# Altium schematic sheet 07_Peripheral_Part.SchDoc
size A3; SheetNumber: 7; SheetTotal: 8
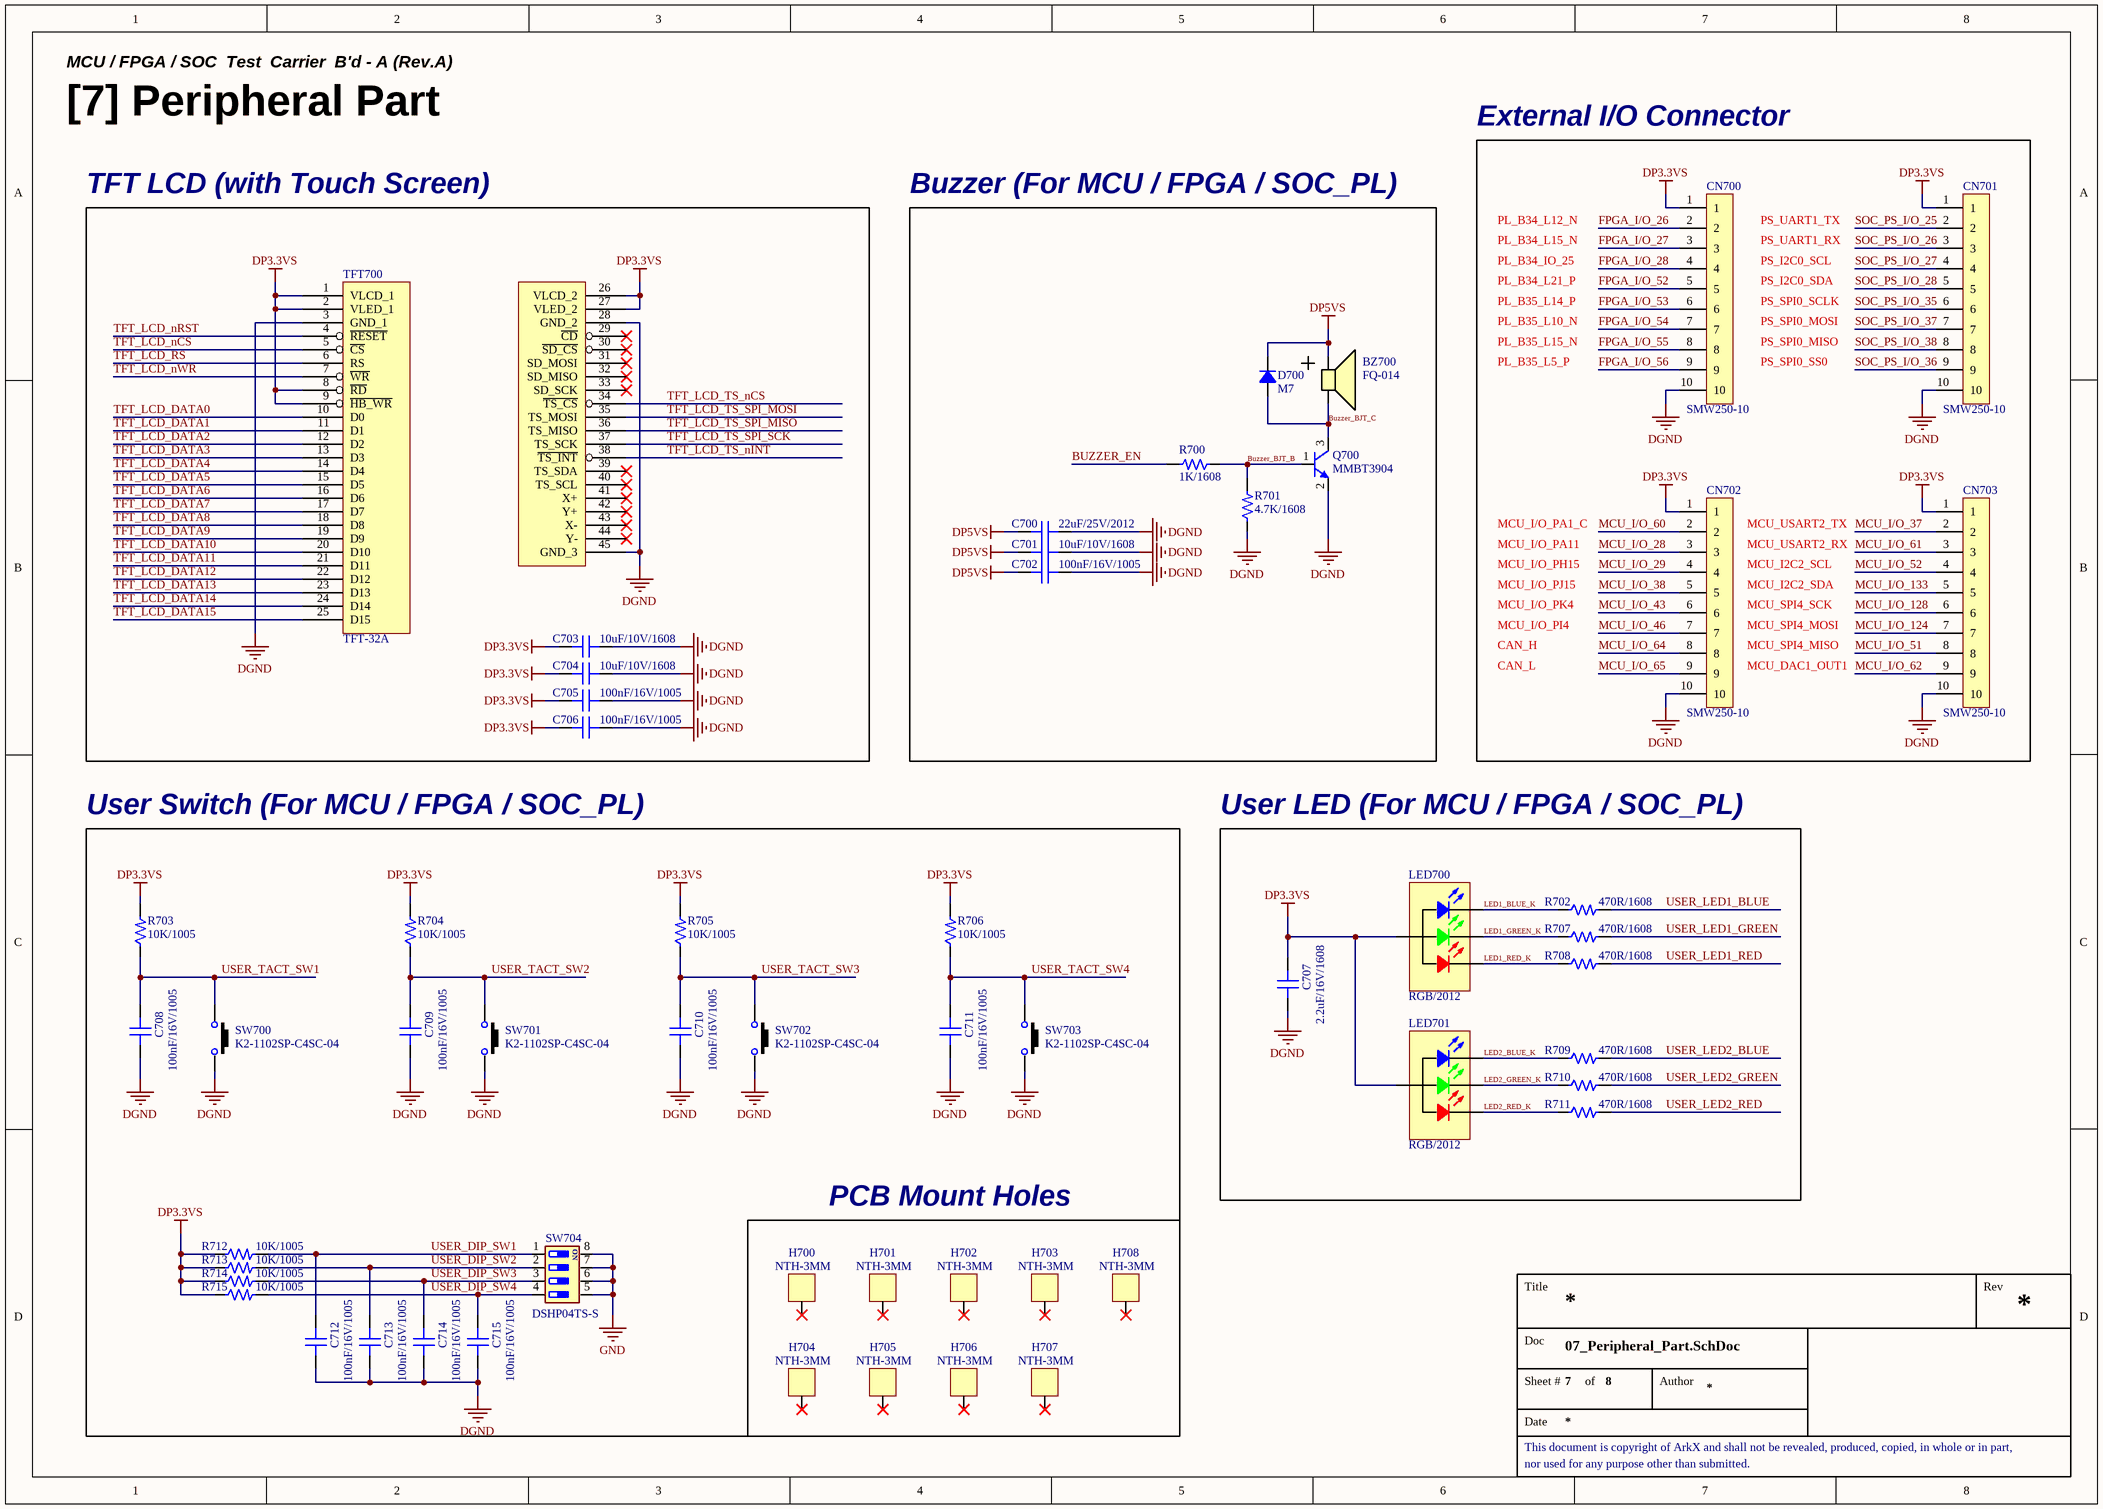
[diagram p0: 07_Peripheral_Part.SchDoc]

## Parts
BZ700  FQ-014  [BUZ FQ-013]
C700  22uF/25V/2012  [CAP 2012 (0805_INCH)]
C701  10uF/10V/1608  [CAP 1608 (0603_INCH)]
C702  100nF/16V/1005  [CAP 1005 (0402_INCH)]
C703  10uF/10V/1608  [CAP 1608 (0603_INCH)]
C704  10uF/10V/1608  [CAP 1608 (0603_INCH)]
C705  100nF/16V/1005  [CAP 1005 (0402_INCH)]
C706  100nF/16V/1005  [CAP 1005 (0402_INCH)]
C707  2.2uF/16V/1608  [CAP 1608 (0603_INCH)]
C708  100nF/16V/1005  [CAP 1005 (0402_INCH)]
C709  100nF/16V/1005  [CAP 1005 (0402_INCH)]
C710  100nF/16V/1005  [CAP 1005 (0402_INCH)]
C711  100nF/16V/1005  [CAP 1005 (0402_INCH)]
C712  100nF/16V/1005  [CAP 1005 (0402_INCH)]
C713  100nF/16V/1005  [CAP 1005 (0402_INCH)]
C714  100nF/16V/1005  [CAP 1005 (0402_INCH)]
C715  100nF/16V/1005  [CAP 1005 (0402_INCH)]
CN700  SMW250-10  [CON_SMW250-10]
CN701  SMW250-10  [CON_SMW250-10]
CN702  SMW250-10  [CON_SMW250-10]
CN703  SMW250-10  [CON_SMW250-10]
D700  M7  [DIO DO-214AC (SMA)]
H700  NTH-3MM  [HOLE_NTH-3.0MM]
H701  NTH-3MM  [HOLE_NTH-3.0MM]
H702  NTH-3MM  [HOLE_NTH-3.0MM]
H703  NTH-3MM  [HOLE_NTH-3.0MM]
H704  NTH-3MM  [HOLE_NTH-3.0MM]
H705  NTH-3MM  [HOLE_NTH-3.0MM]
H706  NTH-3MM  [HOLE_NTH-3.0MM]
H707  NTH-3MM  [HOLE_NTH-3.0MM]
H708  NTH-3MM  [HOLE_NTH-3.0MM]
LED700  RGB/2012  [LED MHT170RGBCT]
LED701  RGB/2012  [LED MHT170RGBCT]
Q700  MMBT3904  [SOT 23-3 (DIODES INCORPORATED)]
R700  1K/1608  [RES 1608 (0603_inch)]
R701  4.7K/1608  [RES 1608 (0603_inch)]
R702  470R/1608  [RES 1608 (0603_inch)]
R703  10K/1005  [RES 1005 (0402_inch)]
R704  10K/1005  [RES 1005 (0402_inch)]
R705  10K/1005  [RES 1005 (0402_inch)]
R706  10K/1005  [RES 1005 (0402_inch)]
R707  470R/1608  [RES 1608 (0603_inch)]
R708  470R/1608  [RES 1608 (0603_inch)]
R709  470R/1608  [RES 1608 (0603_inch)]
R710  470R/1608  [RES 1608 (0603_inch)]
R711  470R/1608  [RES 1608 (0603_inch)]
R712  10K/1005  [RES 1005 (0402_inch)]
R713  10K/1005  [RES 1005 (0402_inch)]
R714  10K/1005  [RES 1005 (0402_inch)]
R715  10K/1005  [RES 1005 (0402_inch)]
SW700  K2-1102SP-C4SC-04  [SW K2-1102SP-C4SC-04]
SW701  K2-1102SP-C4SC-04  [SW K2-1102SP-C4SC-04]
SW702  K2-1102SP-C4SC-04  [SW K2-1102SP-C4SC-04]
SW703  K2-1102SP-C4SC-04  [SW K2-1102SP-C4SC-04]
SW704  DSHP04TS-S  [SW_DSHP04TS-S]
TFT700  TFT-32A  [LCD_TFT-32A]

## Blocks framed on the sheet
External I/O Connector: CN700-CN703
TFT LCD (with Touch Screen): C703-C706 TFT700
Buzzer (For MCU / FPGA / SOC_PL): BZ700 C700-C702 D700 Q700 R700 R701
User Switch (For MCU / FPGA / SOC_PL): C708-C715 R703-R706 R712-R715 SW700-SW704
User LED (For MCU / FPGA / SOC_PL): C707 LED700 LED701 R702 R707-R711
PCB Mount Holes: H700-H708

## Nets
DGND: C700.2 C701.1 C702.1 C703.1 C704.1 C705.1 C706.1 C707.2 C708.1 C709.1 C710.1 C711.1 C712.1 C713.1 C714.1 C715.1 CN700.10 CN701.10 CN702.10 CN703.10 Q700.2(E) R701.1 SW700.3 SW701.3 SW702.3 SW703.3 TFT700.3(GND_1) TFT700.28(GND_2) TFT700.45(GND_3)
DP3.3VS: C703.2 C704.2 C705.2 C706.2 C707.1 CN700.1 CN701.1 CN702.1 CN703.1 LED700.4(Common_Anode) LED701.4(Common_Anode) R703.2 R704.2 R705.2 R706.2 R712.1 R713.1 R714.1 R715.1 TFT700.1(VLCD_1) TFT700.2(VLED_1) TFT700.8(~{RD}) TFT700.9(~{HB_WR}) TFT700.26(VLCD_2) TFT700.27(VLED_2)
DP5VS: BZ700.1 C700.1 C701.2 C702.2 D700.2
GND: SW704.5 SW704.6 SW704.7 SW704.8
Buzzer_BJT_B: Q700.1(B) R700.1 R701.2
Buzzer_BJT_C: BZ700.2 D700.1 Q700.3(C)
BUZZER_EN: R700.2
FPGA_I/O_26: CN700.2
FPGA_I/O_27: CN700.3
FPGA_I/O_28: CN700.4
FPGA_I/O_52: CN700.5
FPGA_I/O_53: CN700.6
FPGA_I/O_54: CN700.7
FPGA_I/O_55: CN700.8
FPGA_I/O_56: CN700.9
LED1_BLUE_K: LED700.3(BLUE) R702.1
LED1_GREEN_K: LED700.2(GREEN) R707.1
LED1_RED_K: LED700.1(RED) R708.1
LED2_BLUE_K: LED701.3(BLUE) R709.1
LED2_GREEN_K: LED701.2(GREEN) R710.1
LED2_RED_K: LED701.1(RED) R711.1
MCU_I/O_28: CN702.3
MCU_I/O_29: CN702.4
MCU_I/O_37: CN703.2
MCU_I/O_38: CN702.5
MCU_I/O_43: CN702.6
MCU_I/O_46: CN702.7
MCU_I/O_51: CN703.8
MCU_I/O_52: CN703.4
MCU_I/O_60: CN702.2
MCU_I/O_61: CN703.3
MCU_I/O_62: CN703.9
MCU_I/O_64: CN702.8
MCU_I/O_65: CN702.9
MCU_I/O_124: CN703.7
MCU_I/O_128: CN703.6
MCU_I/O_133: CN703.5
SOC_PS_I/O_25: CN701.2
SOC_PS_I/O_26: CN701.3
SOC_PS_I/O_27: CN701.4
SOC_PS_I/O_28: CN701.5
SOC_PS_I/O_35: CN701.6
SOC_PS_I/O_36: CN701.9
SOC_PS_I/O_37: CN701.7
SOC_PS_I/O_38: CN701.8
TFT_LCD_DATA0: TFT700.10(D0)
TFT_LCD_DATA1: TFT700.11(D1)
TFT_LCD_DATA2: TFT700.12(D2)
TFT_LCD_DATA3: TFT700.13(D3)
TFT_LCD_DATA4: TFT700.14(D4)
TFT_LCD_DATA5: TFT700.15(D5)
TFT_LCD_DATA6: TFT700.16(D6)
TFT_LCD_DATA7: TFT700.17(D7)
TFT_LCD_DATA8: TFT700.18(D8)
TFT_LCD_DATA9: TFT700.19(D9)
TFT_LCD_DATA10: TFT700.20(D10)
TFT_LCD_DATA11: TFT700.21(D11)
TFT_LCD_DATA12: TFT700.22(D12)
TFT_LCD_DATA13: TFT700.23(D13)
TFT_LCD_DATA14: TFT700.24(D14)
TFT_LCD_DATA15: TFT700.25(D15)
TFT_LCD_nCS: TFT700.5(~{CS})
TFT_LCD_nRST: TFT700.4(~{RESET})
TFT_LCD_nWR: TFT700.7(~{WR})
TFT_LCD_RS: TFT700.6(RS)
TFT_LCD_TS_nCS: TFT700.34(~{TS_CS})
TFT_LCD_TS_nINT: TFT700.38(~{TS_INT})
TFT_LCD_TS_SPI_MISO: TFT700.36(TS_MISO)
TFT_LCD_TS_SPI_MOSI: TFT700.35(TS_MOSI)
TFT_LCD_TS_SPI_SCK: TFT700.37(TS_SCK)
USER_DIP_SW1: C712.2 R712.2 SW704.1
USER_DIP_SW2: C713.2 R713.2 SW704.2
USER_DIP_SW3: C714.2 R714.2 SW704.3
USER_DIP_SW4: C715.2 R715.2 SW704.4
USER_LED1_BLUE: R702.2
USER_LED1_GREEN: R707.2
USER_LED1_RED: R708.2
USER_LED2_BLUE: R709.2
USER_LED2_GREEN: R710.2
USER_LED2_RED: R711.2
USER_TACT_SW1: C708.2 R703.1 SW700.1
USER_TACT_SW2: C709.2 R704.1 SW701.1
USER_TACT_SW3: C710.2 R705.1 SW702.1
USER_TACT_SW4: C711.2 R706.1 SW703.1

Not connected (* = marked no-connect by the designer): H700 1*; H701 1*; H702 1*; H703 1*; H704 1*; H705 1*; H706 1*; H707 1*; H708 1*; TFT700 29(~{CD})* 30(~{SD_CS})* 31(SD_MOSI)* 32(SD_MISO)* 33(SD_SCK)* 39(TS_SDA)* 40(TS_SCL)* 41(X+)* 42(Y+)* 43(X-)* 44(Y-)*

## Notes on the sheet
- MCU / FPGA / SOC  Test  Carrier  B'd - A (Rev.A)
- [7] Peripheral Part
- PL_B34_L12_N
- PL_B34_L15_N
- PS_UART1_TX
- PS_UART1_RX
- PL_B34_IO_25
- PL_B34_L21_P
- PL_B35_L14_P
- PS_I2C0_SCL
- PS_I2C0_SDA
- PS_SPI0_SCLK
- PL_B35_L10_N
- PL_B35_L15_N
- PL_B35_L5_P
- PS_SPI0_SS0
- PS_SPI0_MOSI
- PS_SPI0_MISO
- MCU_I/O_PA1_C
- MCU_I/O_PA11
- MCU_I/O_PH15
- MCU_I/O_PJ15
- (near CN702) MCU_USART2_TX
- (near CN702) MCU_USART2_RX
- (near CN702) MCU_I2C2_SCL
- (near CN702) MCU_I2C2_SDA
- CAN_H
- MCU_I/O_PK4
- MCU_I/O_PI4
- (near CN702) MCU_SPI4_SCK
- (near CN702) MCU_SPI4_MISO
- (near CN702) MCU_SPI4_MOSI
- CAN_L
- (near CN702) MCU_DAC1_OUT1
- Title
- Rev
- Doc
- Sheet #
- of
- Author
- This document is copyright of ArkX and shall not be revealed, produced, copied, in whole or in part,
- Date
- nor used for any purpose other than submitted.
- (in symbol SW_DSHP04TS-S) ON

## Library data of the parts
BZ700 = BZ_FQ-014: Magnetic Active Buzzer / Rated Voltage: 5V / Size: 9x5.5mm
C700 = CAP_22uF/25V/2012: Ceramic CAP_22uF/25V/2012; LCSC Part #: C45783; JLCPCB Part Type: Basic Part
C701 C703 C704 = CAP_10uF/10V/1608: Ceramic CAP_10uF/10V/1608; LCSC Part #: C19702; JLCPCB Part Type: Basic Part
C702 C705 C706 C708-C715 = CAP_100nF/16V/1005: Ceramic CAP_100nF/16V/1005; LCSC Part #: C1525; JLCPCB Part Type: Basic Part
C707 = CAP_2.2uF/16V/1608: Ceramic CAP_2.2uF/16V/1608; LCSC Part #: C23630; JLCPCB Part Type: Basic Part
CN700-CN703 = CON_SMW250-10: YEONHO 2.5mm Pitch Vertical Connector 10Pin
D700 = DIO_M7: 1A 5uA@1kV 1kV 1.1V@1A SMA(DO-214AC)  Diodes - General Purpose ROHS; LCSC Part #: C95872; JLCPCB Part Type: Basic Part
H700-H708 = HOLE_NTH-3.0MM: Non-Through Hole 3mm
LED700 LED701 = LED_RGB_MHT170RGBCT: Colorless transparence -30℃~+85℃ Positive post Common anode RGB 120° 0805  Light Emitting Diodes (LED) ROHS; LCSC Part #: C2962094; JLCPCB Part Type: Extended Part
Q700 = BJT_NPN_MMBT3904: 100nA 40V 200mW 200mA 100@10mA,1V 300MHz 300mV@50mA,5mA NPN +150℃@(Tj) SOT-23(SOT-23-3)  Bipolar Transistors - BJT ROHS; LCSC Part #: C20526; JLCPCB Part Type: Basic Part
R700 = RES_1K/1608/0.1W: Value: 1K; Power Rating: 0.1W; Precision: 1%; Size: 1608; LCSC Part #: C21190; JLCPCB Part Type: Basic Part
R701 = RES_4.7K/1608/0.1W: Value: 4.7K; Power Rating: 0.1W; Precision: 1%; Size: 1608; LCSC Part #: C23162; JLCPCB Part Type: Basic Part
R702 R707-R711 = RES_470R/1608/0.1W: Value: 470R; Power Rating: 0.1W; Precision: 1%; Size: 1608; LCSC Part #: C23179; JLCPCB Part Type: Basic Part
R703-R706 R712-R715 = RES_10K/1005/62.5mW: Value: 10K; Power Rating: 62.5mW; Precision: 1%; Size: 1005; LCSC Part #: C25744; JLCPCB Part Type: Basic Part
SW700-SW703 = SW_K2-1102SP-C4SC-04(2P): -25℃~+85℃ 6mm 5mm Round Button 50mA Brick nogging 6mm SPST 100MΩ 100000 250gf@±30gf 12V SMD  Tactile Switches ROHS; LCSC Part #: C127509; JLCPCB Part Type: Extended Part
SW704 = SW_DSHP04TS-S: 4Bit SPST 24V 25mA Black 3千次 Slide (Standard),凹槽式 SMD-8P,5.4x6.7mm  DIP Switches ROHS; LCSC Part #: C319050; JLCPCB Part Type: Extended Part
TFT700 = LCD_TFT-32A